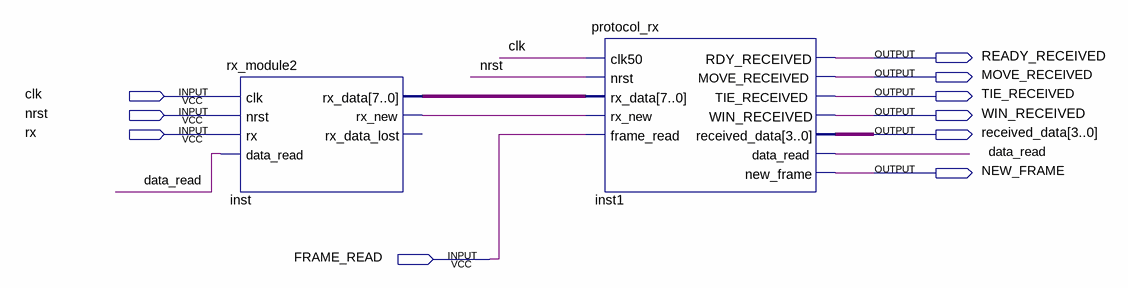
[diagram p0: schematic sheet]
// Quartus schematic RXmodule.bdf as structural Verilog: 2 symbols, 10 pins
module RXmodule (
  input  clk,
  input  nrst,
  input  rx,
  input  FRAME_READ,
  output READY_RECEIVED,
  output MOVE_RECEIVED,
  output TIE_RECEIVED,
  output WIN_RECEIVED,
  output [3:0] received_data,
  output NEW_FRAME
);

  wire data_read, inst_rx_new;
  wire [7:0] inst_rx_data;

  rx_module2 inst (
    .clk(clk), .nrst(nrst), .rx(rx), .data_read(data_read), .rx_data(inst_rx_data), .rx_new(inst_rx_new));  // open: rx_data_lost
  protocol_rx inst1 (
    .clk50(clk), .nrst(nrst), .rx_data(inst_rx_data), .rx_new(inst_rx_new), .frame_read(FRAME_READ),
    .RDY_RECEIVED(READY_RECEIVED), .MOVE_RECEIVED(MOVE_RECEIVED), .TIE_RECEIVED(TIE_RECEIVED),
    .WIN_RECEIVED(WIN_RECEIVED), .received_data(received_data), .data_read(data_read), .new_frame(NEW_FRAME));
endmodule
